# Altium schematic sheet SLAVE.SchDoc
size A; SheetNumber: 6; SheetTotal: 7
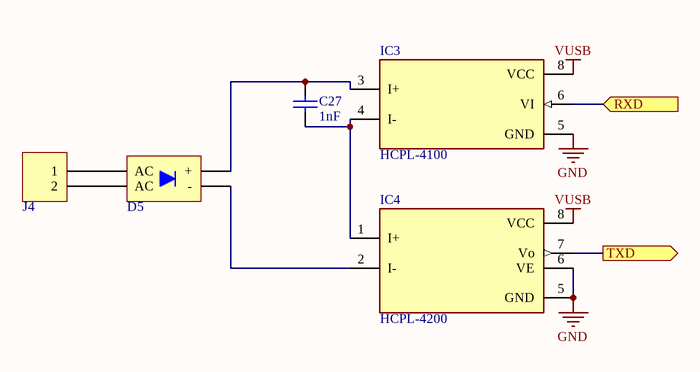
[diagram p0: SLAVE.SchDoc]

## Parts
C27  1nF  [C1206]
D5  HD08  [MINIDIP]  (value not drawn)
IC3  HCPL-4100  [DIP-8]
IC4  HCPL-4200  [DIP-8]
J4  CONN-2  [XH-2]  (value not drawn)

## Ports
RXD (in), TXD (out)

## Nets
GND: IC3.5(GND) IC4.5(GND) IC4.6(VE)
VUSB: IC3.8(VCC) IC4.8(VCC)
RXD: IC3.6(VI) ; port RXD
TXD: IC4.7(Vo) ; port TXD
NetC27_1: C27.1 IC3.4(I-) IC4.1(I+)
NetC27_2: C27.2 D5.1(+) IC3.3(I+)
NetD5_2: D5.2(-) IC4.2(I-)
NetD5_3: D5.3(AC) J4.2
NetD5_4: D5.4(AC) J4.1

## Library data of the parts
C27 = Cap: Capacitor; Designer: Parsa Malekpour; Value: 1nF
IC3 = HCPL-4100: <b>Isolation Amplifer</b><p> Source: http://www.avagotech.com/docs/AV02-0410EN; MF: {'manufacturer': u'Broadcom Limited'}; Package: None; Value: *; Price: None; MP: HCPL-4100; Availability: Unavailable
IC4 = HCPL-4200: Optically Coupled 20 mA Current Loop Receiver; MF: {'manufacturer': u'Broadcom Limited'}; Package: None; Value: *; Price: None; MP: HCPL-4100; Availability: Unavailable